# EAGLE design lawnbot_arduino (EAGLE 5.12)
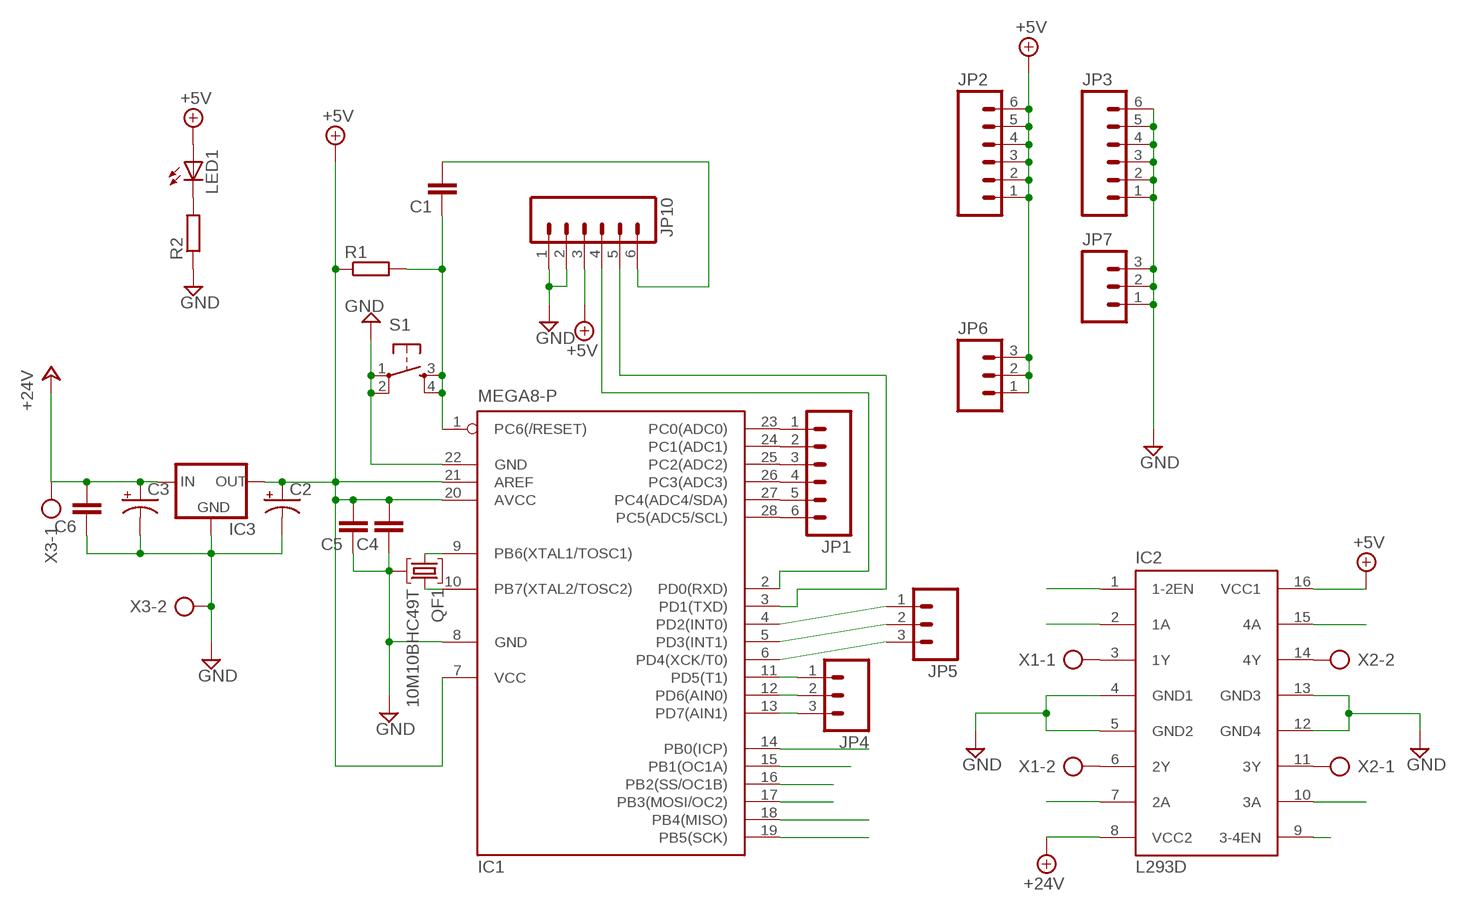
[diagram p0: schematic, sheet 1]

## Parts
C1  CAPPTH1  [CAP-PTH-5MM]
C2  CPOL-USE2.5-7  [E2,5-7]
C3  CPOL-USE3.5-8  [E3,5-8]
C4  CAPPTH1  [CAP-PTH-5MM]
C5  CAPPTH1  [CAP-PTH-5MM]
C6  CAPPTH1  [CAP-PTH-5MM]
IC1  MEGA8-P  [DIL28-3]
IC2  L293D  [DIL16]
IC3  V_REG_78XX-TO-220  [TO-220-ALT]
JP1  M06SIP  [1X06]
JP2  M06SIP  [1X06]
JP3  M06SIP  [1X06]
JP4  M03PTH  [1X03]
JP5  M03PTH  [1X03]
JP6  M03PTH  [1X03]
JP7  M03PTH  [1X03]
JP10  M06SIP  [1X06]
LED1  LED3MM  [LED3MM]
QF1  10M10BHC49T  [HC49U]
R1  R-EU_0204/5  [0204/5]
R2  R-EU_0204/5  [0204/5]
S1  TAC_SWITCHPTH  [TACTILE-PTH]
X1  AK500/2  [AK500/2]
X2  AK500/2  [AK500/2]
X3  AK500/2  [AK500/2]

## Nets
+5V: C2.+ C4.2 C5.2 IC1.7(VCC) IC1.20(AVCC) IC1.21(AREF) IC2.16(VCC1) IC3.OUT JP2.1 JP2.2 JP2.3 JP2.4 JP2.5 JP2.6 JP6.1 JP6.2 JP6.3 JP10.3 LED1.A R1.1
+24V: C3.+ C6.2 IC2.8(VCC2) IC3.IN X3.1
EN_12: IC1.15(PB1(OC1A)) IC2.1(1-2EN)
EN_34: IC1.17(PB3(MOSI/OC2)) IC2.9(3-4EN)
GND: C2.- C3.- C4.1 C5.1 C6.1 IC1.8(GND) IC1.22(GND) IC2.4(GND1) IC2.5(GND2) IC2.12(GND4) IC2.13(GND3) IC3.GND JP3.1 JP3.2 JP3.3 JP3.4 JP3.5 JP3.6 JP7.1 JP7.2 JP7.3 JP10.1 JP10.2 QF1.2 R2.1 S1.1 S1.2 X3.2
IN_1A: IC1.14(PB0(ICP)) IC2.2(1A)
IN_2A: IC1.16(PB2(SS/OC1B)) IC2.7(2A)
IN_3A: IC1.18(PB4(MISO)) IC2.10(3A)
IN_4A: IC1.19(PB5(SCK)) IC2.15(4A)
N$1: IC2.3(1Y) X1.1
N$2: IC1.10(PB7(XTAL2/TOSC2)) QF1.3
N$3: IC1.9(PB6(XTAL1/TOSC1)) QF1.1
N$4: IC2.6(2Y) X1.2
N$5: IC1.23(PC0(ADC0)) JP1.1
N$6: IC2.14(4Y) X2.2
N$7: IC2.11(3Y) X2.1
N$8: IC1.24(PC1(ADC1)) JP1.2
N$9: IC1.25(PC2(ADC2)) JP1.3
N$10: IC1.26(PC3(ADC3)) JP1.4
N$11: IC1.27(PC4(ADC4/SDA)) JP1.5
N$12: IC1.28(PC5(ADC5/SCL)) JP1.6
N$13: IC1.11(PD5(T1)) JP4.1
N$14: IC1.12(PD6(AIN0)) JP4.2
N$15: IC1.13(PD7(AIN1)) JP4.3
N$16: IC1.4(PD2(INT0)) JP5.1
N$17: IC1.5(PD3(INT1)) JP5.2
N$18: IC1.6(PD4(XCK/T0)) JP5.3
N$19: LED1.K(C) R2.2
N$23: IC1.3(PD1(TXD)) JP10.5
N$25: IC1.2(PD0(RXD)) JP10.4
N$27: C1.1 IC1.1(PC6(/RESET)) R1.2 S1.3 S1.4
N$28: C1.2 JP10.6

## Library data of the parts
C1 C4-C6 = SparkFun:CAP: Capacitor Standard 0603 ceramic capacitor, and 0.1" leaded capacitor.
C2 C3 = resistor:CPOL-US: POLARIZED CAPACITOR, American symbol
IC1 = atmel:MEGA8-P: MICROCONTROLLER 8 Kbytes FLASH, 1 kbytes SRAM, 512 bytes EEPROM, USART, 4-channel 10 bit ADC, 2-channel 8 bit ADC Pin compatible with Atmega48, ATMega88, ATMega168 Source: avr.lbr; OC_FARNELL: unknown; OC_NEWARK: unknown
IC2 = st-microelectronics:L293D: PUSH-PULL 4 CHANNEL DRIVER; MPN: L293D; OC_FARNELL: 9589619; OC_NEWARK: 56P8249
IC3 = SparkFun:V_REG_78XX: Voltage Regulator Standard 7805 5V regulator. IGO (Input Ground Output). Spark Fun Electronics SKU : COM-00107
JP1-JP3 JP10 = SparkFun:M06: Header 6 Standard 6-pin 0.1" header. Use with straight break away headers (SKU : PRT-00116), right angle break away headers (PRT-00553), swiss pins (PRT-00743), machine pins (PRT-00117), and female headers (PRT-00115). Molex polarized connector foot print use with SKU : PRT-08094 with associated crimp pins and housings. NOTES ON THE VARIANTS LOCK and LOCK_LONGPADS... This footprint was designed to help hold the alignment of a through-hole component (i.e. 6-pin header) while soldering it into place. You may notice that each hole has been shifted either up or down by 0.005 of an inch from it's more standard position (which is a perfectly straight line). This slight alteration caused the pins (the squares in the middle) to touch the edges of the holes. Because they are alternating, it causes a "brace" to hold the component in place. 0.005 has proven to be the perfect amount of "off-center" position when using our standard breakaway headers. Although looks a little odd when you look at the bare footprint, once you have a header in there, the alteration is very hard to notice. Also, if you push a header all the way into place, it is covered up entirely on the bottom side. This idea of altering the position of holes to aid alignment will be further integrated into the Sparkfun Library for other footprints. It can help hold any component with 3 or more connection pins.
JP4-JP7 = SparkFun:M03: Header 3 Standard 3-pin 0.1" header. Use with straight break away headers (SKU : PRT-00116), right angle break away headers (PRT-00553), swiss pins (PRT-00743), machine pins (PRT-00117), and female headers (PRT-00115). Molex polarized connector foot print use with SKU : PRT-08232 with associated crimp pins and housings.
LED1 = led:LED: LED OSRAM: - CHIPLED LG R971, LG N971, LY N971, LG Q971, LY Q971, LO R971, LY R971 LH N974, LH R974 LS Q976, LO Q976, LY Q976 LO Q996 - Hyper CHIPLED LW Q18S LB Q993, LB Q99A, LB R99A - SideLED LS A670, LO A670, LY A670, LG A670, LP A670 LB A673, LV A673, LT A673, LW A673 LH A674 LY A675 LS A676, LA A676, LO A676, LY A676, LW A676 LS A679, LY A679, LG A679 - Hyper Micro SIDELED® LS Y876, LA Y876, LO Y876, LY Y876 LT Y87S - SmartLED LW L88C, LW L88S LB L89C, LB L89S, LG L890 LS L89K, LO L89K, LY L89K LS L896, LA L896, LO L896, LY L896 - TOPLED LS T670, LO T670, LY T670, LG T670, LP T670 LSG T670, LSP T670, LSY T670, LOP T670, LYG T670 LG T671, LOG T671, LSG T671 LB T673, LV T673, LT T673, LW T673 LH T674 LS T676, LA T676, LO T676, LY T676, LB T676, LH T676, LSB T676, LW T676 LB T67C, LV T67C, LT T67C, LS T67K, LO T67K, LY T67K, LW E67C LS E67B, LA E67B, LO E67B, LY E67B, LB E67C, LV E67C, LT E67C LW T67C LS T679, LY T679, LG T679 LS T770, LO T770, LY T770, LG T770, LP T770 LB T773, LV T773, LT T773, LW T773 LH T774 LS E675, LA E675, LY E675, LS T675 LS T776, LA T776, LO T776, LY T776, LB T776 LHGB T686 LT T68C, LB T68C - Hyper Mini TOPLED® LB M676 - Mini TOPLED Santana® LG M470 LS M47K, LO M47K, LY M47K Source: http://www.osram.convergy.de LUXEON: - LUMILED® LXK2-PW12-R00, LXK2-PW12-S00, LXK2-PW14-U00, LXK2-PW14-V00 LXK2-PM12-R00, LXK2-PM12-S00, LXK2-PM14-U00 LXK2-PE12-Q00, LXK2-PE12-R00, LXK2-PE12-S00, LXK2-PE14-T00, LXK2-PE14-U00 LXK2-PB12-K00, LXK2-PB12-L00, LXK2-PB12-M00, LXK2-PB14-N00, LXK2-PB14-P00, LXK2-PB14-Q00 LXK2-PR12-L00, LXK2-PR12-M00, LXK2-PR14-Q00, LXK2-PR14-R00 LXK2-PD12-Q00, LXK2-PD12-R00, LXK2-PD12-S00 LXK2-PH12-R00, LXK2-PH12-S00 LXK2-PL12-P00, LXK2-PL12-Q00, LXK2-PL12-R00 Source: www.luxeon.com KINGBRIGHT: KA-3528ASYC Source: www.kingbright.com
QF1 = crystal:10M*B: Monolithic Crystal Filters Source: www.vanlong.com; OC_FARNELL: unknown; OC_NEWARK: unknown
R1 R2 = rcl:R-EU_: RESISTOR, European symbol
S1 = SparkFun:TAC_SWITCH: Momentary Switch Button commonly used for reset or general input. Spark Fun Electronics SKU : COM-00097
X1-X3 = con-ptr500:AK500/2: CONNECTOR; OC_FARNELL: unknown; OC_NEWARK: unknown

## Board
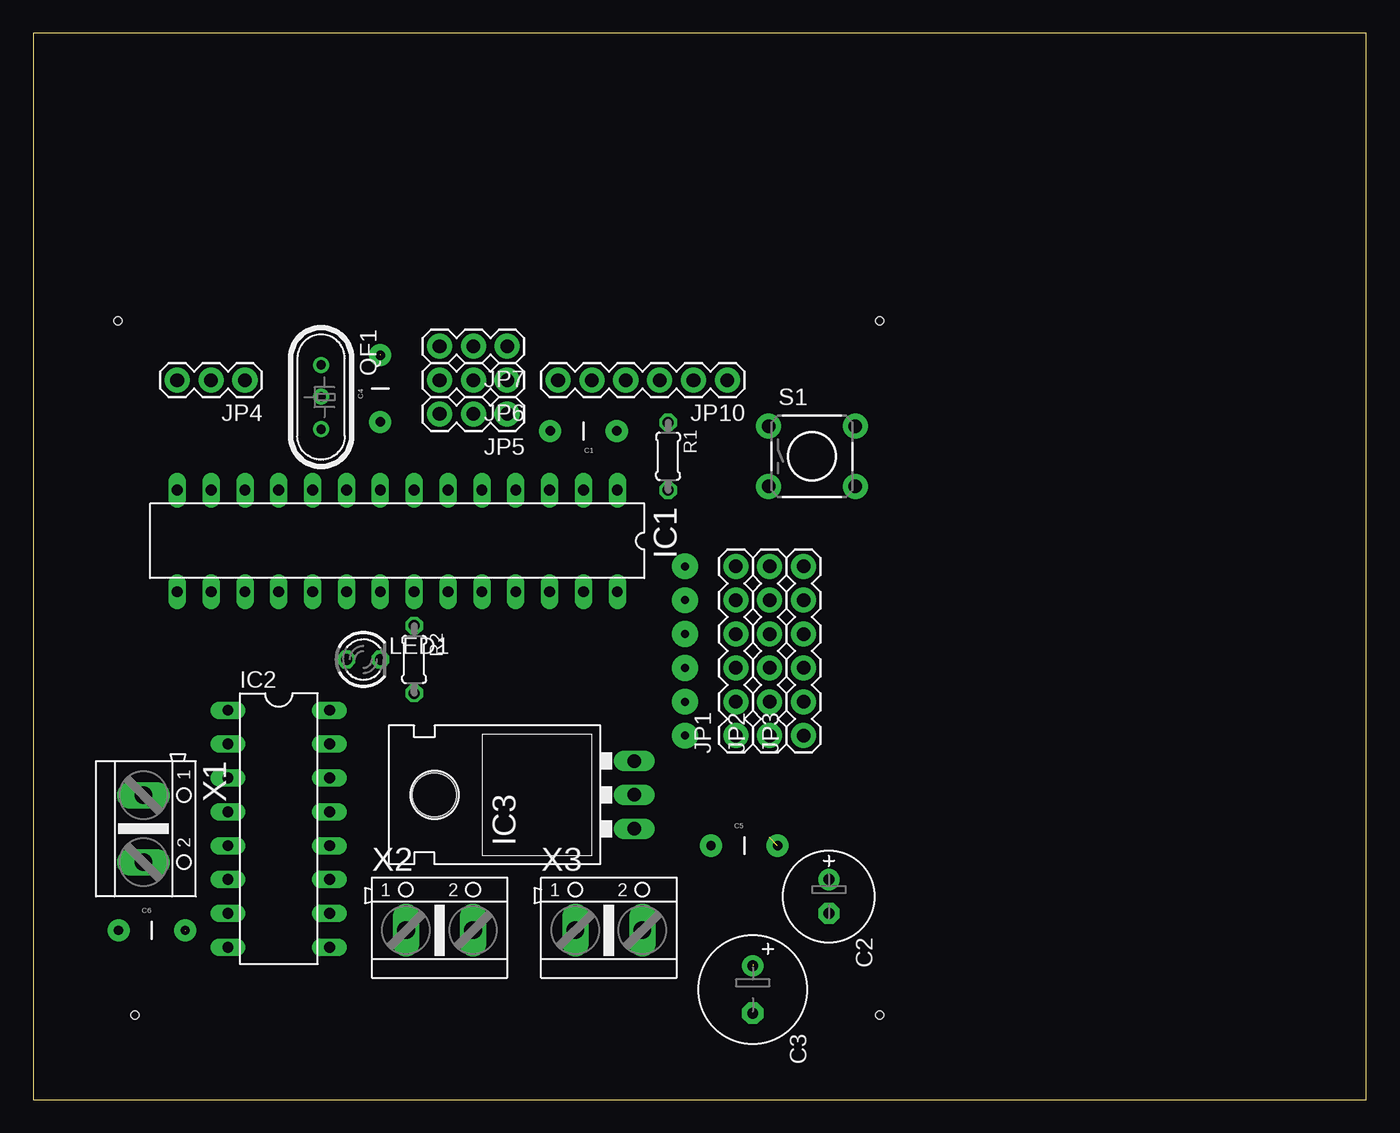
[diagram p1: board, top side]
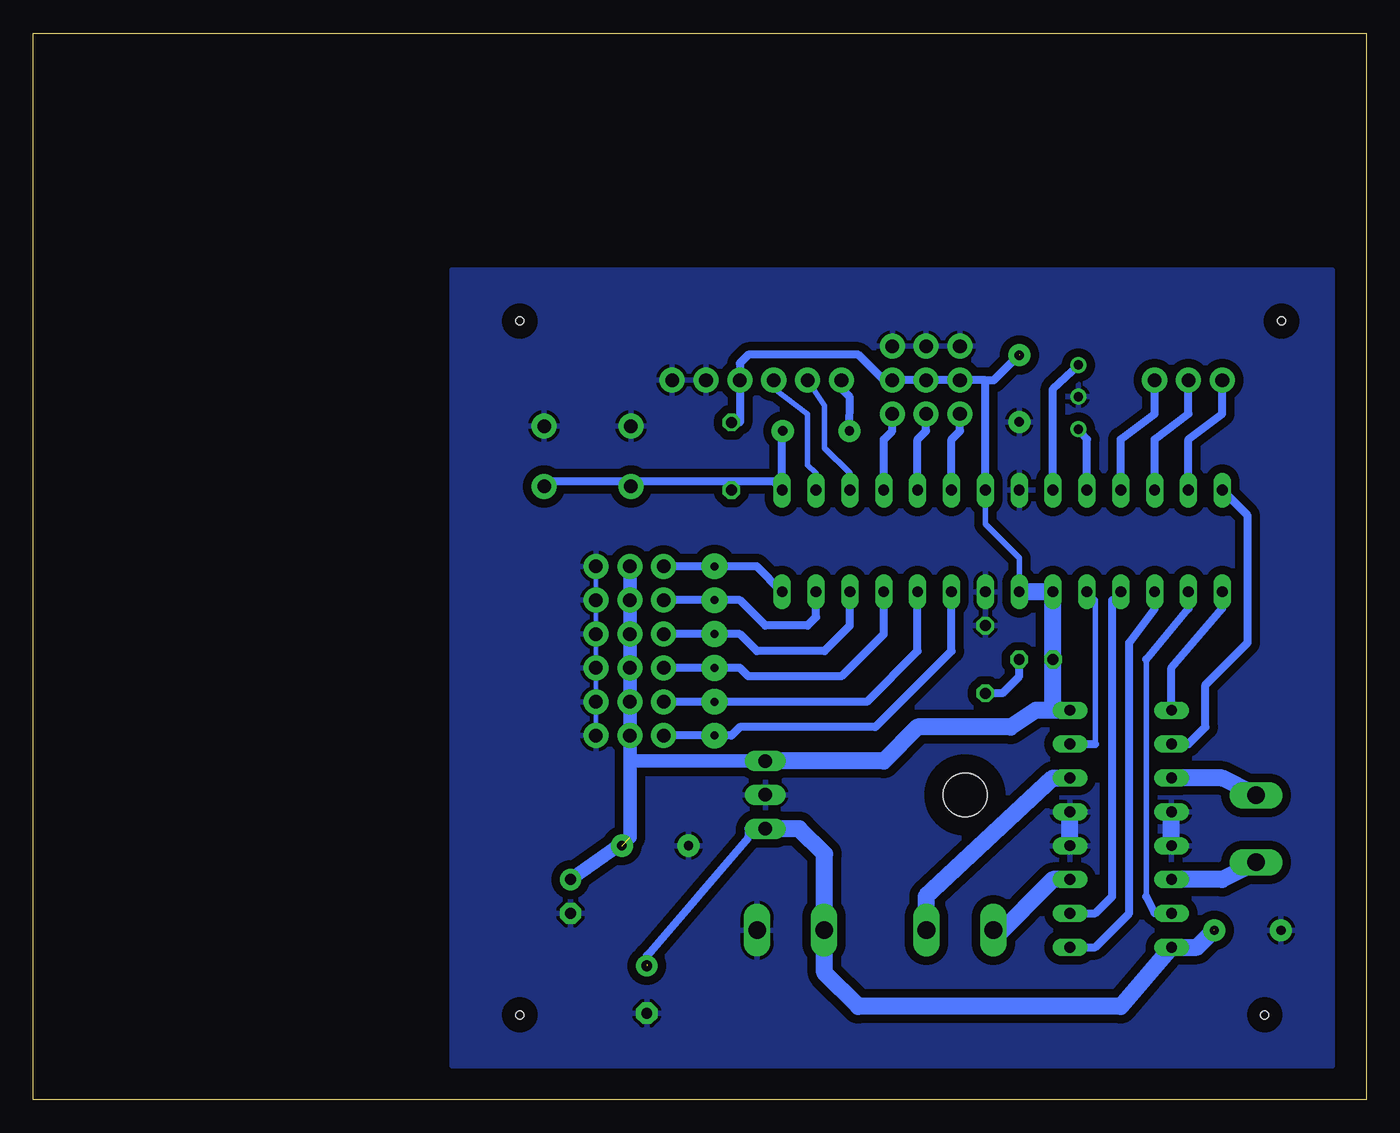
[diagram p2: board, bottom side, seen from below]

Size 100 x 80 mm. Coordinates in mm from the lower left corner, seen from the top.
Outline: 0,0 100,0 100,80 0,80 0,0
Copper layers (1*16): Top 0.035mm / dielectric 1.5mm / Bottom 0.035mm
Design rules "default *": minimum track width 10mil, minimum drill 24mil, track to track 25mil, track to pad 25mil, pad to pad 8mil, via to via 8mil, smd to smd 8mil, copper to edge 40mil, drill to drill 8mil, minimum pad ring 10mil, minimum via ring 8mil, stop-mask expansion 4mil, vias tented up to drill 0mil, thermal gap 10mil
Holes 0.6 mm at 6.35,58.42 63.5,58.42 63.5,6.35 7.62,6.35

### Footprints (pad centres in the part's own frame; a part is rotated, then mirrored left to right if it is on the bottom)
CAP-PTH-5MM = drill 0.7 pad 1.651 round: 1 -2.5,0; 2 2.5,0
E2,5-7 = drill 0.813 pad 1.6 round: + -1.27,0 | drill 0.813 pad 1.6 octagon: - 1.27,0
E3,5-8 = drill 0.813 pad 1.6 round: + -1.778,0 | drill 0.813 pad 1.6 octagon: - 1.778,0
DIL28-3 = drill 0.813 long: 1 -16.51,-3.81; 2 -13.97,-3.81; 3 -11.43,-3.81; 4 -8.89,-3.81; 5 -6.35,-3.81; 6 -3.81,-3.81; 7 -1.27,-3.81; 8 1.27,-3.81; 9 3.81,-3.81; 10 6.35,-3.81; 11 8.89,-3.81; 12 11.43,-3.81; 13 13.97,-3.81; 14 16.51,-3.81; 15 16.51,3.81; 16 13.97,3.81; 17 11.43,3.81; 18 8.89,3.81; 19 6.35,3.81; 20 3.81,3.81; 21 1.27,3.81; 22 -1.27,3.81; 23 -3.81,3.81; 24 -6.35,3.81; 25 -8.89,3.81; 26 -11.43,3.81; 27 -13.97,3.81; 28 -16.51,3.81
DIL16 = drill 0.813 long: 1 -8.89,-3.81; 2 -6.35,-3.81; 3 -3.81,-3.81; 4 -1.27,-3.81; 5 1.27,-3.81; 6 3.81,-3.81; 7 6.35,-3.81; 8 8.89,-3.81; 9 8.89,3.81; 10 6.35,3.81; 11 3.81,3.81; 12 1.27,3.81; 13 -1.27,3.81; 14 -3.81,3.81; 15 -6.35,3.81; 16 -8.89,3.81
TO-220-ALT = drill 1.016 long: GND 0,-3.81; IN -2.54,-3.81; OUT 2.54,-3.81 | hole 3.302: 0,11.176
1X06 = drill 1.016 pad 1.88 round: 1 0,0; 2 2.54,0; 3 5.08,0; 4 7.62,0; 5 10.16,0; 6 12.7,0
1X03 = drill 1.016 pad 1.88 round: 1 0,0; 2 2.54,0; 3 5.08,0
LED3MM = drill 0.813 octagon: A -1.27,0; K 1.27,0
HC49U = drill 0.7 pad 1.2 round: 1 -2.413,0; 2 -0.027,0; 3 2.413,0
0204/5 = drill 0.813 octagon: 1 -2.54,0; 2 2.54,0
TACTILE-PTH = drill 1.016 pad 1.88 round: 1 -3.251,2.261; 2 3.251,2.261; 3 -3.251,-2.261; 4 3.251,-2.261
AK500/2 = drill 1.321 long: 1 -2.515,0; 2 2.515,0

### Placement (x,y rotation side)
C1  41.27,50.16 180 top
C2  59.69,15.24 270 top
C3  53.98,8.26 270 top
C4  26.04,53.34 90 top
C5  53.34,19.05 0 top
C6  8.89,12.7 0 top
IC1  27.3,41.91 180 top
IC2  18.41,20.32 270 top
IC3  41.27,22.86 90 top
JP1  52.7,27.3 90 top
JP2  55.24,27.3 90 top
JP3  57.78,27.3 90 top
JP4  15.88,53.98 180 top
JP5  35.56,51.44 180 top
JP6  35.56,53.98 180 top
JP7  35.56,56.52 180 top
JP10  52.07,53.98 180 top
LED1  24.77,33.02 0 top
QF1  21.59,52.7 270 top
R1  47.62,48.26 270 top
R2  28.57,33.02 270 top
S1  58.42,48.26 0 top
X1  8.26,20.32 270 top
X2  30.48,12.7 0 top
X3  43.18,12.7 0 top

### Tracks (layer width: path | path; a pad name or v marks a point on that pad's centre or on a via)
+5V  (2 unrouted)
  Bottom 0.305: JP2.1 JP2.2 JP2.3 JP2.4 JP2.5 JP2.6 | JP6.1 36.2,53.98
  Bottom 0.406: IC1.21 26.04,40.64 28.57,43.18 IC1.7
  Bottom 0.61: R1.1 46.99,50.8 JP10.3 46.99,55.24 46.35,55.88 38.1,55.88 36.2,53.98 | 26.04,55.88 27.94,53.98 28.57,53.98 | IC1.7 28.57,53.98 | 28.57,53.98 JP6.3 JP6.2 JP6.1
  Bottom 1.016: 55.24,25.4 JP2.6 | 55.24,25.4 55.24,19.68 C2.+ | IC3.OUT 55.24,25.4
  Bottom 1.27: IC1.21 IC1.20 LED1.A 23.5,29.21 IC2.16 24.77,29.21 26.67,27.94 33.66,27.94 36.2,25.4 IC3.OUT
+24V  (2 unrouted)
  Bottom 0.254: 40.64,12.06 X3.1
  Bottom 0.61: 53.98,10.16 53.98,10.79 46.35,19.68 46.35,20.32 IC3.IN
  Bottom 1.27: IC3.IN 42.55,20.32 40.64,18.41 40.64,12.06 40.64,9.53 38.1,6.99 18.41,6.99 IC2.8 12.7,11.43 11.43,12.7
EN_12
  Bottom 0.406: 10.79,36.83 IC1.15
  Bottom 0.61: 10.79,36.83 14.61,32.38 IC2.1
EN_34
  Bottom 0.406: 15.88,36.83 IC1.17
  Bottom 0.61: IC2.9 20.32,11.43 17.78,13.97 17.78,34.29 15.88,36.83
GND
  Bottom 0.305: JP3.1 JP3.2 JP3.3 JP3.4 JP3.5 JP3.6
  Bottom 1.27: IC2.5 IC2.4 | IC2.12 IC2.13
  pour Bottom: 2.54,62.23 2.54,2.54 68.58,2.54 68.58,62.23
IN_1A
  Bottom 0.406: IC2.2 13.34,26.67
  Bottom 0.61: 13.34,26.67 12.06,27.94 12.06,31.11 8.89,34.29 8.89,43.81 IC1.14
IN_2A
  Bottom 0.406: 13.34,36.83 IC1.16 | 16.51,15.24 16.51,33.02 | IC2.7 15.88,13.97
  Bottom 0.61: 16.51,33.02 13.34,36.83 | 15.88,13.97 16.51,15.24
IN_3A
  Bottom 0.406: 19.05,37.47 IC1.18
  Bottom 0.61: 19.05,37.47 19.05,15.24 20.32,13.97 IC2.10
IN_4A
  Bottom 0.406: 20.32,26.67 20.32,37.47 IC1.19
  Bottom 0.61: IC2.15 20.32,26.67
N$1
  Bottom 0.254: X1.1 8.26,23.5 8.51,22.99
  Bottom 1.27: IC2.3 10.79,24.13 8.51,22.99 8.26,22.86
N$2
  Bottom 0.61: IC1.10 20.95,49.53 QF1.3
N$3
  Bottom 0.61: IC1.9 23.5,53.34 QF1.1
N$4
  Bottom 0.254: 8.26,18.41 X1.2 8.26,17.78
  Bottom 1.27: IC2.6 10.79,16.51 8.26,17.78
N$5  (via drill 0.6 pad 1.93)
  Bottom 0.61: JP1.1 v48.9,27.3 47.62,27.3 46.99,27.94 36.83,27.94 31.11,33.66 IC1.23
N$6
  Bottom 0.254: 33.02,15.24 32.38,13.34 X2.2
  Bottom 1.27: IC2.14 23.5,24.13 33.02,15.24 33.02,12.06
N$7
  Bottom 0.254: 27.94,12.06 X2.1
  Bottom 1.27: 27.94,12.06 23.5,16.51 IC2.11
N$8  (via drill 0.6 pad 1.93)
  Bottom 0.61: JP1.2 v48.9,29.84 37.47,29.84 33.66,33.66 IC1.24
N$9  (via drill 0.6 pad 1.93)
  Bottom 0.61: JP1.3 v48.9,32.38 46.99,32.38 46.35,31.75 39.37,31.75 36.2,34.92 IC1.25
N$10  (via drill 0.6 pad 1.93)
  Bottom 0.61: JP1.4 v48.9,34.92 46.99,34.92 45.72,33.66 40.64,33.66 38.73,35.56 IC1.26
N$11  (via drill 0.6 pad 1.93)
  Bottom 0.61: JP1.5 v48.9,37.47 46.99,37.47 45.09,35.56 41.91,35.56 41.27,36.2 IC1.27
N$12  (via drill 0.6 pad 1.93)
  Bottom 0.61: IC1.28 45.72,40.01 v48.9,40.01 JP1.6
N$13
  Bottom 0.61: IC1.11 18.41,49.53 15.88,51.44 JP4.1
N$14
  Bottom 0.61: IC1.12 15.88,49.53 13.34,51.44 JP4.2
N$15
  Bottom 0.61: IC1.13 13.34,49.53 10.79,51.44 JP4.3
N$16
  Bottom 0.61: IC1.4 36.2,49.53 35.56,50.16 JP5.1
N$17
  Bottom 0.61: IC1.5 33.66,49.53 33.02,50.16 JP5.2
N$18
  Bottom 0.61: IC1.6 31.11,49.53 30.48,50.16 JP5.3
N$19
  Bottom 0.61: LED1.K 26.04,31.75 27.3,30.48 R2.2
N$23
  Bottom 0.406: JP10.5 40.64,52.07 40.64,48.9 38.73,46.99 IC1.3
N$25
  Bottom 0.406: IC1.2 41.27,46.99 41.91,47.62 41.91,51.44 44.45,53.34 JP10.4
N$27
  Bottom 0.254: 43.81,50.16 C1.1
  Bottom 0.61: IC1.1 44.45,46.35 47.62,46.35 | 43.81,45.09 IC1.1 | IC1.1 43.81,50.16 | 47.62,46.35 R1.2 | 47.62,46.35 55.24,46.35 | S1.4 61.67,46.28 61.59,46.35 55.24,46.35 | 55.24,46.35 55.24,46 | 55.24,46.35 S1.3
N$28
  Bottom 0.61: JP10.6 39.37,53.34 38.73,52.7 C1.2